# Altium schematic sheet Driver.SchDoc: Driver
size A; DrawnBy: Brent; DocumentNumber: XXXXXX; Revision: A; SheetNumber: 3; SheetTotal: 8
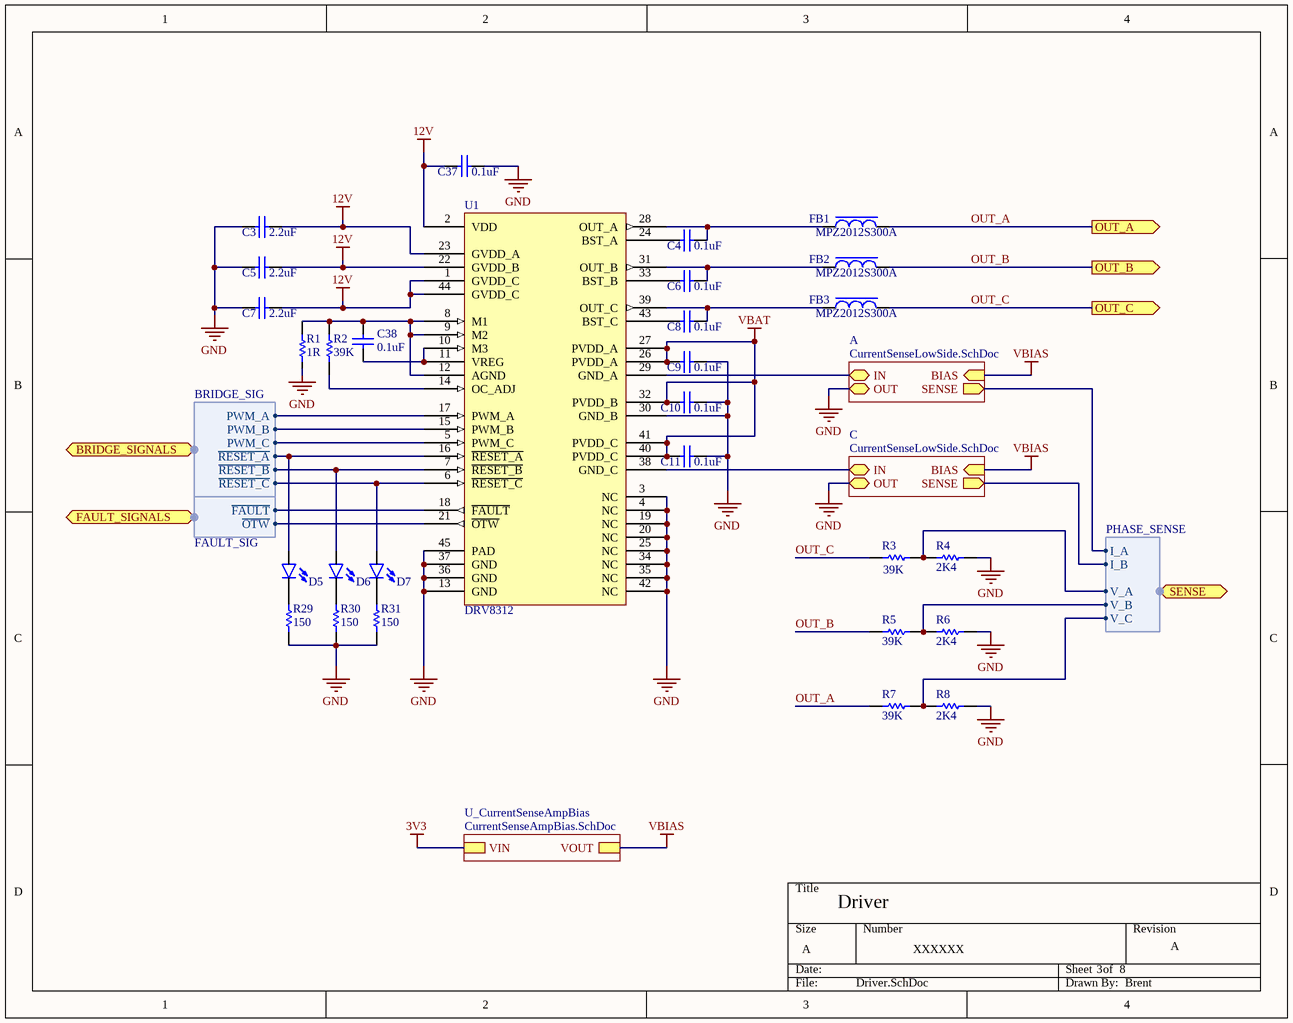
[diagram p0: Driver.SchDoc]

## Parts
C3  2.2uF  [CAPC0603(1608)100_L]
C4  0.1uF  [CAPC0603(1608)100_L]
C5  2.2uF  [CAPC0603(1608)100_L]
C6  0.1uF  [CAPC0603(1608)100_L]
C7  2.2uF  [CAPC0603(1608)100_L]
C8  0.1uF  [CAPC0603(1608)100_L]
C9  0.1uF  [CAPC0603(1608)100_L]
C10  0.1uF  [CAPC0603(1608)100_L]
C11  0.1uF  [CAPC0603(1608)100_L]
C37  0.1uF  [CAPC0603(1608)100_L]
C38  0.1uF  [CAPC0603(1608)100_L]
D5  LED_0603_BLUE_5mA  [LED0603]  (value not drawn)
D6  LED_0603_BLUE_5mA  [LED0603]  (value not drawn)
D7  LED_0603_BLUE_5mA  [LED0603]  (value not drawn)
FB1  MPZ2012S300A  [0805-Ferrite]
FB2  MPZ2012S300A  [0805-Ferrite]
FB3  MPZ2012S300A  [0805-Ferrite]
R1  1R  [RESC0603(1608)_L]
R2  39K  [RESC0603(1608)_L]
R3  39K  [RESC0603(1608)_L]
R4  2K4  [RESC0603(1608)_L]
R5  39K  [RESC0603(1608)_L]
R6  2K4  [RESC0603(1608)_L]
R7  39K  [RESC0603(1608)_L]
R8  2K4  [RESC0603(1608)_L]
R29  150  [RESC0603(1608)_L]
R30  150  [RESC0603(1608)_L]
R31  150  [RESC0603(1608)_L]
U1  DRV8312  [HTSSOP-44E]

## Sub-sheets
A = CurrentSenseLowSide.SchDoc: SENSE (out), BIAS (in), IN, OUT
C = CurrentSenseLowSide.SchDoc: SENSE (out), BIAS (in), IN, OUT
U_CurrentSenseAmpBias = CurrentSenseAmpBias.SchDoc: VIN, VOUT

## Ports
BRIDGE_SIGNALS (harness BRIDGE_SIG), FAULT_SIGNALS (harness FAULT_SIG), OUT_A (out), OUT_B (out), OUT_C (out), SENSE (harness PHASE_SENSE)

## Harnesses
BRIDGE_SIG: PWM_A, PWM_B, PWM_C, ~{RESET_A}, ~{RESET_B}, ~{RESET_C}
PHASE_SENSE: V_C, V_B, V_A, I_B, I_A
FAULT_SIG: ~{FAULT}, ~{OTW}

## Nets
3V3: sheet U_CurrentSenseAmpBias/VIN
12V: C3.1 C5.1 C7.1 C37.1 U1.1(GVDD_C) U1.2(VDD) U1.22(GVDD_B) U1.23(GVDD_A) U1.44(GVDD_C)
GND: C3.2 C5.2 C7.2 C9.2 C10.2 C11.2 C37.2 R1.2 R4.1 R6.1 R8.1 R29.1 R30.1 R31.1 U1.3(NC) U1.4(NC) U1.13(GND) U1.19(NC) U1.20(NC) U1.25(NC) U1.30(GND_B) U1.34(NC) U1.35(NC) U1.36(GND) U1.37(GND) U1.42(NC) U1.45(PAD) ; sheet A/OUT, sheet C/OUT
VBAT: C9.1 C10.1 C11.1 U1.26(PVDD_A) U1.27(PVDD_A) U1.32(PVDD_B) U1.40(PVDD_C) U1.41(PVDD_C)
VBIAS: sheet A/BIAS, sheet C/BIAS, sheet U_CurrentSenseAmpBias/VOUT
OUT_A: FB1.2 R7.2 ; port OUT_A
OUT_B: FB2.2 R5.2 ; port OUT_B
OUT_C: FB3.2 R3.2 ; port OUT_C
NetC4_1: C4.1 U1.24(BST_A)
NetC4_2: C4.2 FB1.1 U1.28(OUT_A)
NetC6_1: C6.1 U1.33(BST_B)
NetC6_2: C6.2 FB2.1 U1.31(OUT_B)
NetC8_1: C8.1 U1.43(BST_C)
NetC8_2: C8.2 FB3.1 U1.39(OUT_C)
NetC38_1: C38.1 U1.10(M3) U1.11(VREG)
NetC38_2: C38.2 R1.1 R2.2 U1.8(M1) U1.9(M2) U1.12(AGND)
NetD5_A: D5.A U1.16(~{RESET_A}) ; port BRIDGE_SIGNALS.~{RESET_A}
NetD5_C: D5.C R29.2
NetD6_A: D6.A U1.7(~{RESET_B}) ; port BRIDGE_SIGNALS.~{RESET_B}
NetD6_C: D6.C R30.2
NetD7_A: D7.A U1.6(~{RESET_C}) ; port BRIDGE_SIGNALS.~{RESET_C}
NetD7_C: D7.C R31.2
NetR2_1: R2.1 U1.14(OC_ADJ)
NetR3_1: R3.1 R4.2 ; port SENSE.V_A
NetR5_1: R5.1 R6.2 ; port SENSE.V_B
NetR7_1: R7.1 R8.2 ; port SENSE.V_C
NetU1_5: U1.5(PWM_C) ; port BRIDGE_SIGNALS.PWM_C
NetU1_15: U1.15(PWM_B) ; port BRIDGE_SIGNALS.PWM_B
NetU1_17: U1.17(PWM_A) ; port BRIDGE_SIGNALS.PWM_A
NetU1_18: U1.18(~{FAULT}) ; port FAULT_SIGNALS.~{FAULT}
NetU1_21: U1.21(~{OTW}) ; port FAULT_SIGNALS.~{OTW}
NetU1_29: U1.29(GND_A) ; sheet A/IN
NetU1_38: U1.38(GND_C) ; sheet C/IN
(unnamed): sheet A/SENSE, port SENSE.I_A
(unnamed): sheet C/SENSE, port SENSE.I_B

## Library data of the parts
C3 C5 C7 = CMP-1035-02767-1: CAP 2.2uF 25V ±10% 0603 (1608 Metric) Thickness 1mm SMD; Case-EIA: 0603; Tolerance: Â±10%; Case-Metric: 1608; Technology: SMT; Value: 2.2uF; Max Thickness: 1 mm; Rated Voltage: 25 V
C4 C6 C8-C11 C37 C38 = CMP-1035-02595-1: CAP 100nF 100V ±10% 0603 (1608 Metric) Thickness 1mm SMD; Tolerance: Â±10%; Case-EIA: 0603; Case-Metric: 1608; Rated Voltage: 100 V; Value: 100nF; Technology: SMT; Max Thickness: 1 mm
D5-D7 = LED_0603_BLUE_5mA: PartNumber: LTST-C193TBKT-5A; Manufacturer: Lite-On Inc.; PackageReference: 0603; PackageDescription: 0603 (1608 Metric); Mounting Technology: Surface Mount
R1 = CMP-1012-00002-1: 1R 0.1W 5% 0603 (1608 Metric)  SMD; Value: 1.00 Ohm; Case-Metric: 1608; Case-EIA: 0603; Power: 0.1 W; Technology: SMT; Tolerance: 5 %
R2 R3 R5 R7 = CMP-1012-00689-1: 39K 0.1W 1% 0603 (1608 Metric)  SMD; Case-Metric: 1608; Case-EIA: 0603; Value: 39000.00 Ohm; Technology: SMT; Tolerance: 1 %; Power: 0.1 W
R4 R6 R8 = CMP-1012-00551-1: 2K4 0.1W 1% 0603 (1608 Metric)  SMD; Case-EIA: 0603; Case-Metric: 1608; Value: 2400.00 Ohm; Technology: SMT; Tolerance: 1 %; Power: 0.1 W
R29-R31 = CMP-1012-00415-1: 150R 0.1W 1% 0603 (1608 Metric)  SMD; Case-Metric: 1608; Value: 150.00 Ohm; Case-EIA: 0603; Tolerance: 1 %; Power: 0.1 W; Technology: SMT